# EAGLE design C64_PSU_Z66 (EAGLE 9.6.2)
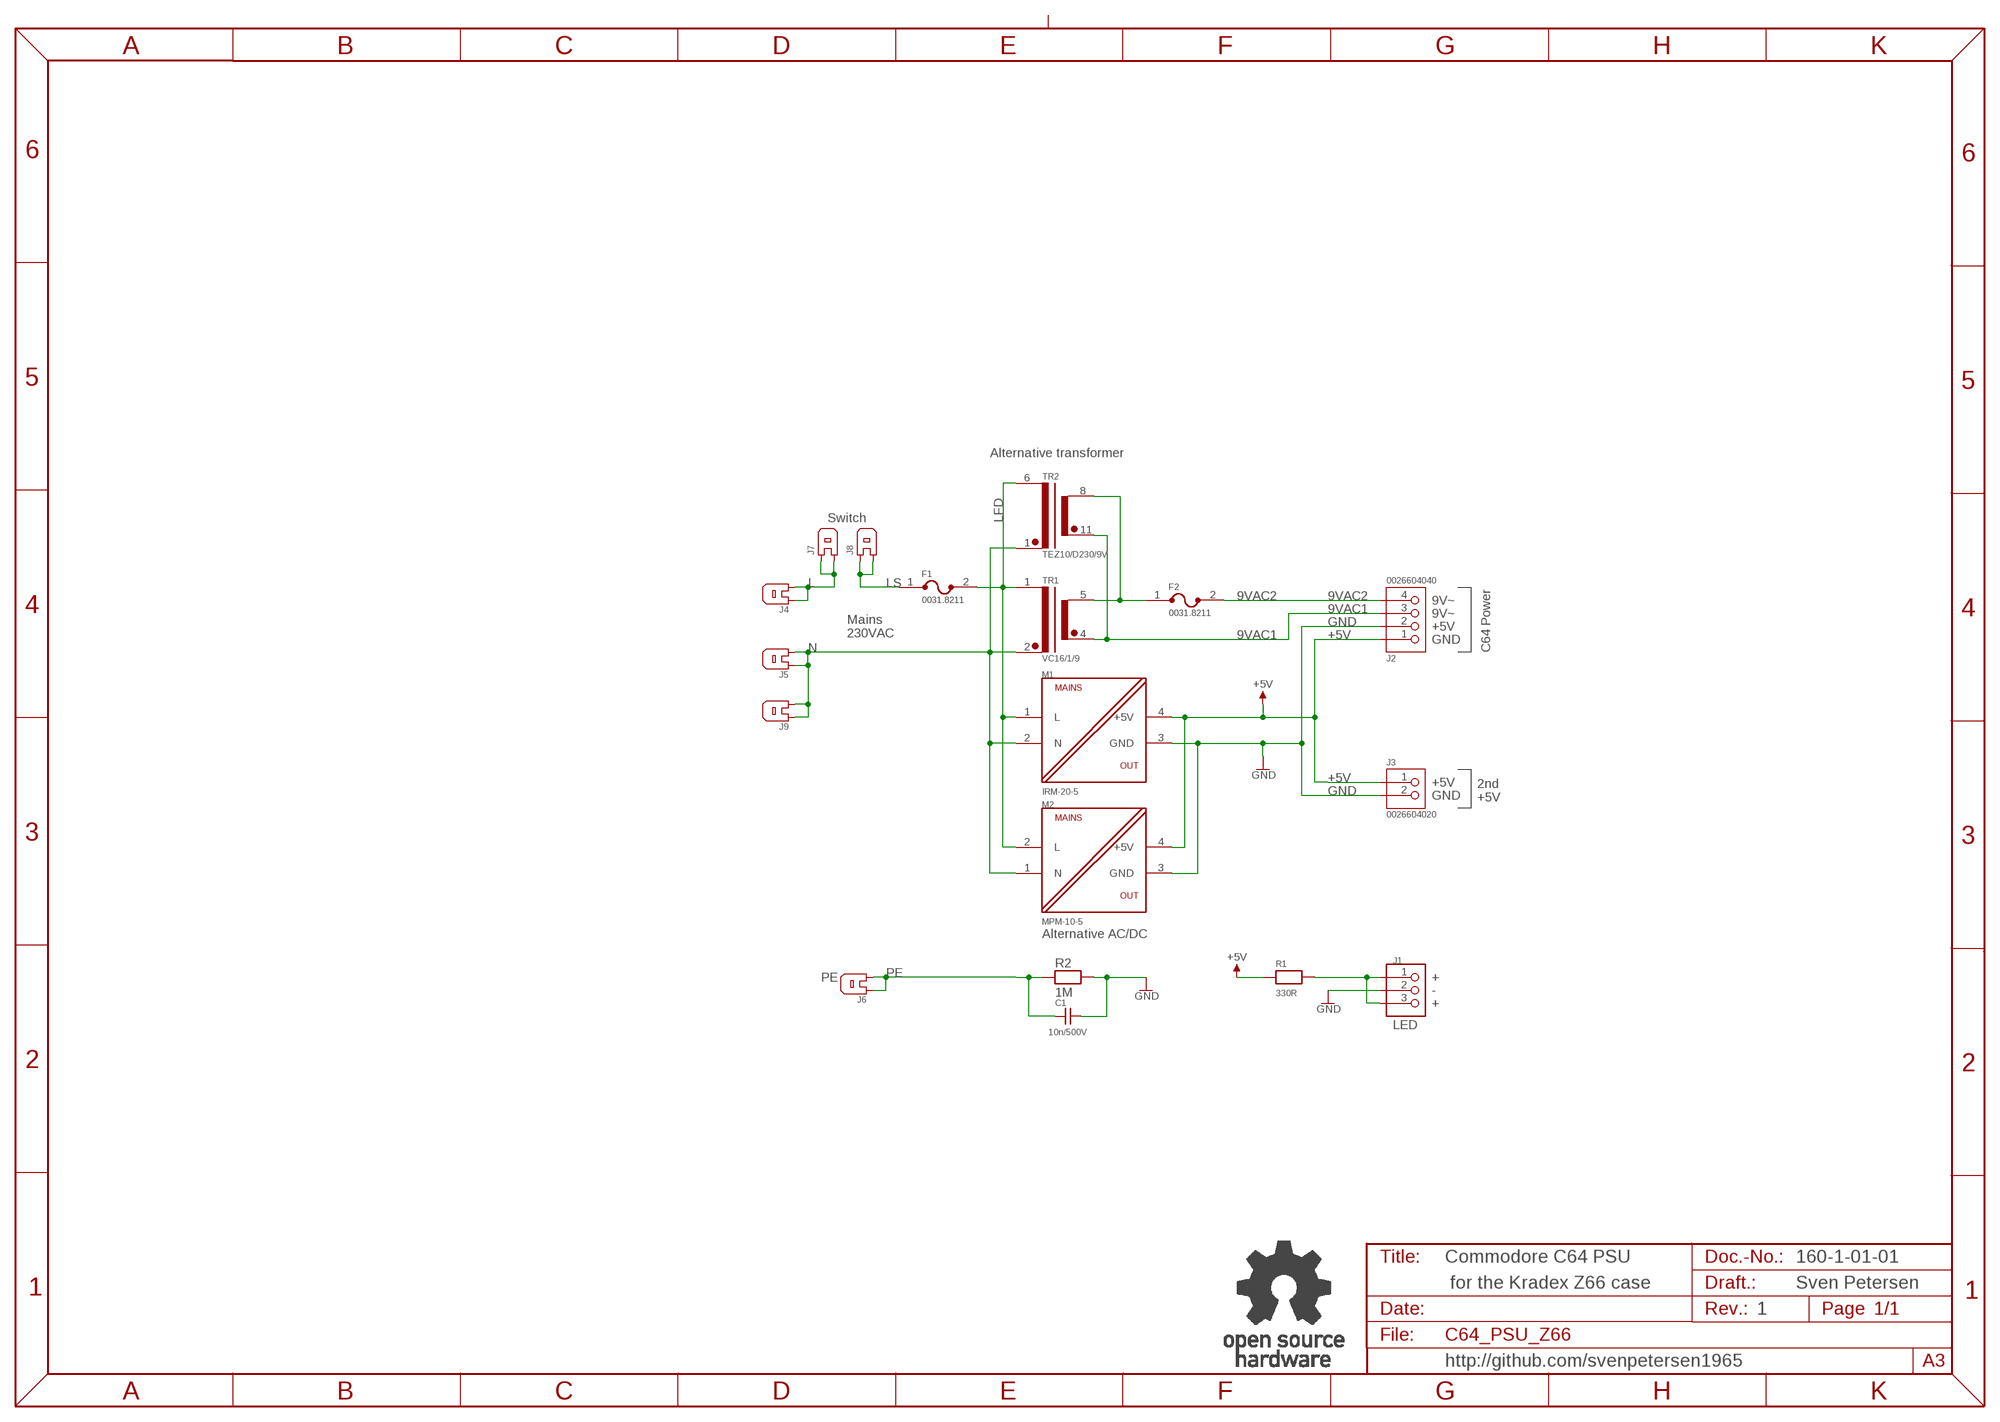
[diagram p0: schematic, sheet 1]

## Parts
C1  10n/500V  CAP02  [C-5]
F1  0031.8211  [0031.8211]
F2  0031.8211  [0031.8211]
J1  PINHD-1X3  [1X03]
J2  0026604040  [SPOX_3.96_4P]
J3  0026604020  [SPOX_3.96_2P]
J4  FLA6,3  [FLA6,3]
J5  FLA6,3  [FLA6,3]
J6  FLA6,3  [FLA6,3]
J7  FLA6,3  [FLA6,3]
J8  FLA6,3  [FLA6,3]
J9  FLA6,3  [FLA6,3]
M1  IRM-20-5  [IRM-5-20]
M2  MPM-10-5  [MPM10]
R1  330R  RES04  [R-10]
R2  1M  RES04  [R-10]
TR1  VC16/1/9  [VC16/1/9]
TR2  TEZ10/D230/9V  [TEZ10]
U$8  OPEN_SOURCE_HW  [OPENHW]

## Nets
9VAC1: J2.3 TR1.4(SEC12) TR2.11(SEC12)
9VAC2: F2.2 J2.4
+5V: J2.1 J3.1 M1.4(+5V) M2.4(+5V) R1.1
GND: C1.2 J1.2 J2.2 J3.2 M1.3(GND) M2.3(GND) R2.2
L [mains]: J4.1 J4.2 J7.1 J7.2
LFD [mains]: F1.2 M1.1(L) M2.2(L) TR1.1(PRI1) TR2.6(PRI1)
LS [mains]: F1.1 J8.1 J8.2
N [mains]: J5.1 J5.2 J9.1 J9.2 M1.2(N) M2.1(N) TR1.2(PRI2) TR2.1(PRI2)
N$2: J1.1 J1.3 R1.2
N$3: F2.1 TR1.5(SEC11) TR2.8(SEC11)
PE [PE]: C1.1 J6.1 J6.2 R2.1

## Notes on the sheet
- Alternative transformer
- Switch
- 9V~
- 9V~
- Mains
  230VAC
- +5V
- GND
- C64 Power
- +5V
- GND
- 2nd
  +5V
- Alternative AC/DC
- PE | +
- -
- +
- LED
- Commodore C64 PSU | 160-1-01-01
- for the Kradex Z66 case | Sven Petersen
- 1
- http://github.com/svenpetersen1965

## Library data of the parts
C1 = DISCRETE:CAP02
F1 F2 = Schurter:0031.8211
J1 = PINHEAD:PINHD-1X3
J2 = MOLEX:0026604040
J3 = MOLEX:0026604020
J4-J9 = Connect:FLA6,3
M1 = MeanWell:IRM-20-5
M2 = MeanWell:MPM-10-5
R1 R2 = DISCRETE:RES04
TR1 = Block:VC16/1/9
TR2 = Breve Tufvassons:TEZ10/D230/9V: tme.eu: TEZ10/D/9V
U$8 = Logo:OPEN_SOURCE_HW

## Net classes
0 default: clearance 0.203 mm
1 mains: width 1 mm, clearance 5 mm to class 0, clearance 5 mm
2 PE: clearance 1.5 mm to class 0, clearance 5 mm to class 1, clearance 0.203 mm

## Board
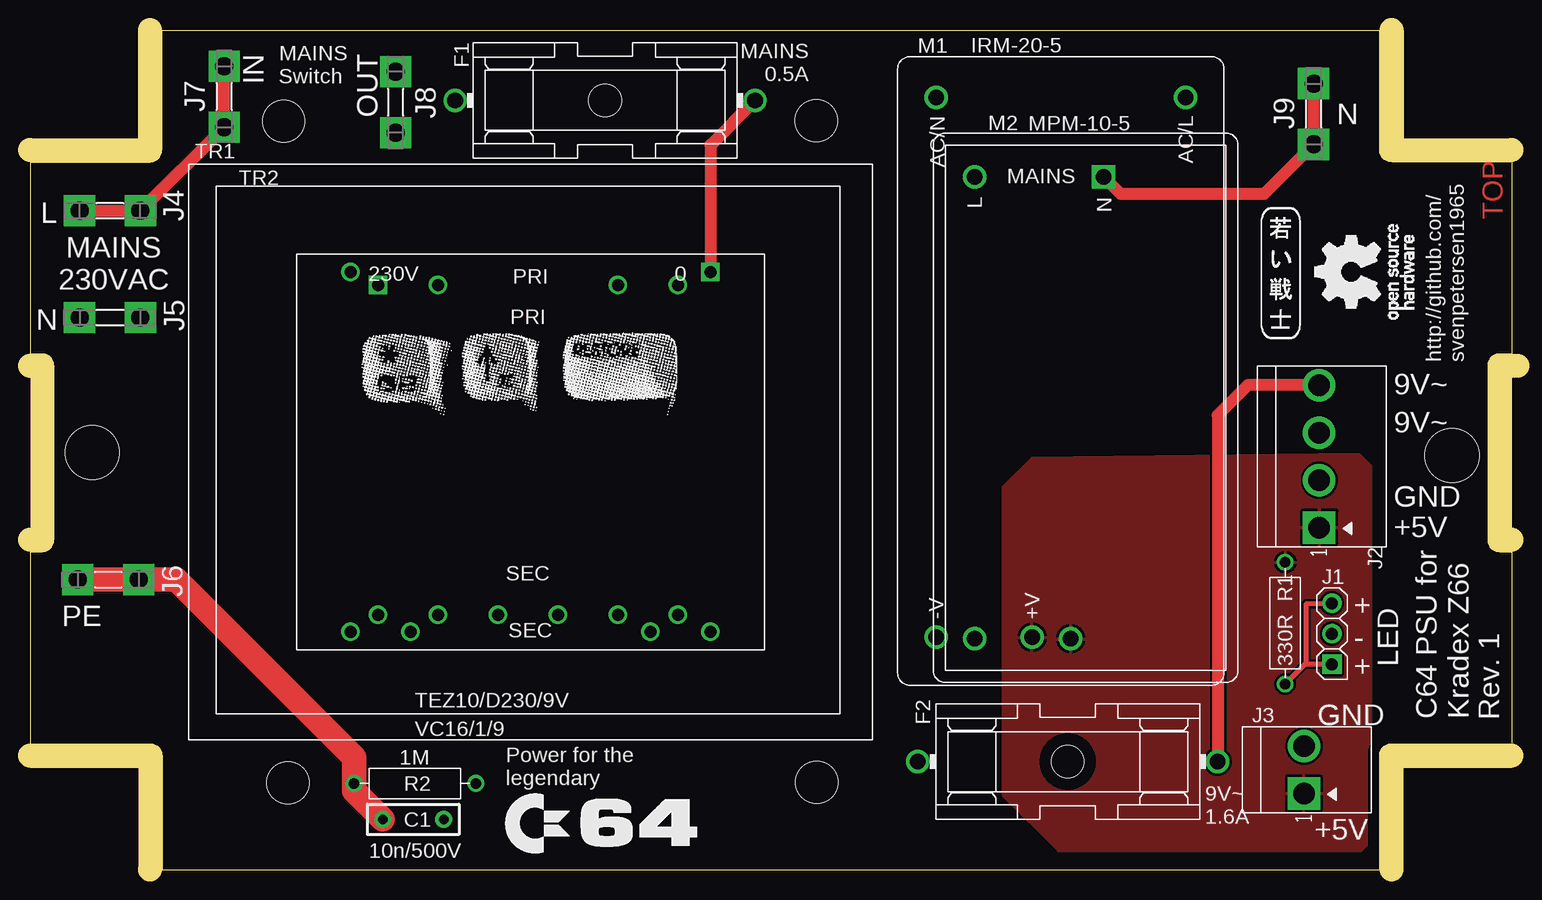
[diagram p1: board, top side]
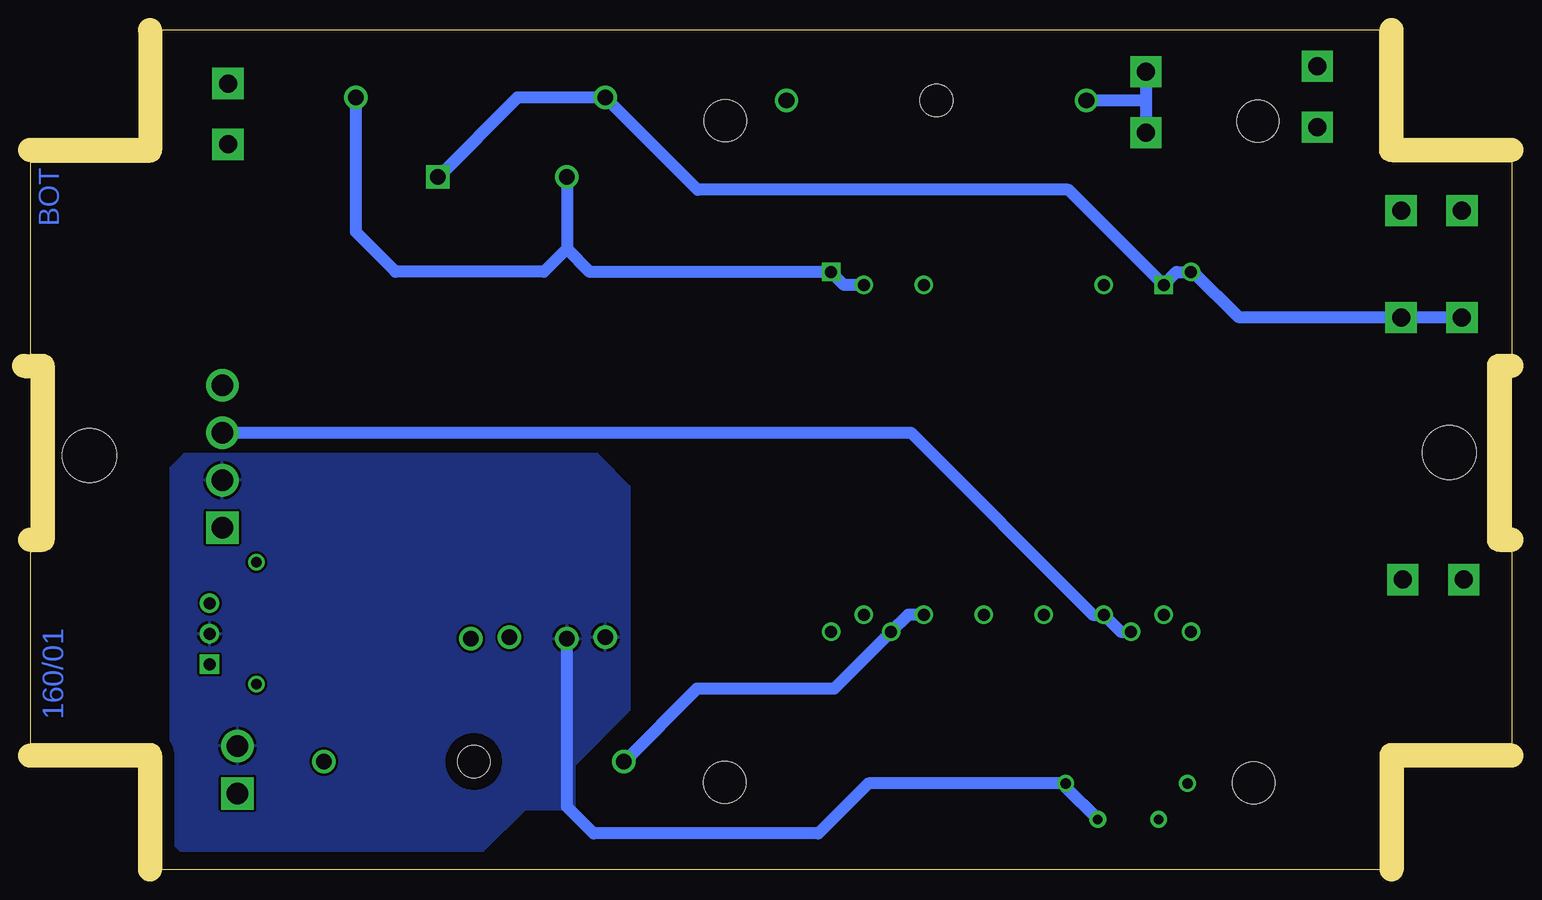
[diagram p2: board, bottom side, seen from below]

Size 123.5 x 70 mm. Coordinates in mm from the lower left corner, seen from the top.
Outline: 11,0 112.5,0 112.5,9.5 arc-90 113.5,10.5 123.5,10.5 123.5,26.5 122.5,26.5 arc-90 121.5,27.5 121.5,42 arc-90 122.5,43 123.5,43 123.5,59 113.5,59 arc-90 112.5,60 112.5,70 11,70 11,60 arc-90 10,59 0,59 0,43 1,43 arc-90 2,42 2,27.5 arc-90 1,26.5 0,26.5 0,10.5 10,10.5 arc-90 11,9.5 11,0
Copper layers (1*16): Top 0.035mm / dielectric 1.5mm / Bottom 0.035mm
Design rules "default *": minimum track width 6mil, minimum drill 0.35mm, track to track 6mil, track to pad 6mil, pad to pad 6mil, via to via 6mil, smd to smd 6mil, copper to edge 40mil, drill to drill 6mil, minimum pad ring 10mil, minimum via ring 8mil, stop-mask expansion 4mil, vias tented up to drill 25mil, thermal gap 10mil
Milling: 14 lines

### Footprints (pad centres in the part's own frame; a part is rotated, then mirrored left to right if it is on the bottom)
C-5 = drill 0.8 pad 1.397: 1 -2.54,0; 2 2.54,0
0031.8211 = drill 1.3: 1 -12.5,0; 2 12.5,0 | hole 2.7: 0,0
1X03 = drill 1 pad 1.626 square: 1 -2.54,0 | drill 1 pad 1.626: 2 0,0; 3 2.54,0
SPOX_3.96_4P = drill 1.8 square: 1 -5.94,0 | drill 1.8: 2 -1.98,0; 3 1.98,0; 4 5.94,0
SPOX_3.96_2P = drill 1.8 square: 1 -1.98,0 | drill 1.8: 2 1.98,0
FLA6,3 = drill 1.5 pad 2.591 square: 1 -2.54,0; 2 2.54,0
IRM-5-20 = drill 1.3: 1 -22.5,10.4; 2 -22.5,-10.4; 3 22.5,-10.4; 4 22.5,-2.4
MPM10 = drill 1.3 square: 1 -19.25,1.5 | drill 1.3: 2 -19.25,-9.25; 3 19.25,-9.25; 4 19.25,-1.25
R-10 = drill 0.889 pad 1.397: 1 -5.08,0; 2 5.08,0
VC16/1/9 = drill 1 square: 1 -15,15 | drill 1: 2 -15,-15; 3 15,-15; 4 15,-10; 5 15,10; 6 15,15
TEZ10 = drill 1 square: 1 -12.5,13.75 | drill 1: 2 -7.5,13.75; 5 7.5,13.75; 6 12.5,13.75; 7 12.5,-13.75; 8 7.5,-13.75; 9 2.5,-13.75; 10 -2.5,-13.75; 11 -7.5,-13.75; 12 -12.5,-13.75
Z66 = hole 4.5: 5.686,35.275; 119.035,35.025 | hole 3.5: 21.651,62.89; 21.996,7.733; 66.041,62.93; 66.076,7.773

### Placement (x,y rotation side)
C1  31.95,4.18 0 top
F1  47.93,64.13 0 top
F2  86.5,9 0 top
J1  108.52,19.66 90 top
J2  107.47,34.45 90 top
J3  106.2,8.32 90 top
J4  6.67,54.93 180 top
J5  6.67,46.02 0 top
J6  6.51,24.17 0 top
J7  16.19,64.45 90 top
J8  30.48,63.98 270 top
J9  107,63 90 top
M1  85.93,41.87 270 top
M2  88,38.5 270 top
R1  104.63,20.54 270 top
R2  32.09,7.18 0 top
TR1  41.71,34.83 270 top
TR2  41.5,35 0 top
U$7  [Z66]  -0.5,-0.5 0 top
U$8  115.35,45.9 90 top
U$9  [C64_LOGO]  39.62,1.35 0 top
U$10  [PCB-TITLE/]  0.16,75.41 0 top  (outside the outline)
U$11  [2LAYER]  122.76,54.22 90 top
U$12  [C64_KEYS]  27.62,37.31 0 top
U$13  [SVEN_TAG]  104.3,49.85 0 top

### Tracks (layer width: path | path; a pad name or v marks a point on that pad's centre or on a via)
9VAC1
  Bottom 1.016: TR1.4 32.58,19.83 TR2.11 34.9,21.25 50.08,36.43 J2.3
9VAC2
  Top 1.016: J2.4 101.51,40.39 99,37.88 F2.2
+5V
  pour Top: 81.12,31.91 81.12,6.19 85.72,1.59 110.97,1.59 111.76,2.38 111.76,33.66 110.81,34.61 83.5,34.29
GND
  Bottom 1.016: C1.2 37.17,6.86 R2.2 53.62,7.18 57.78,3.02 76.52,3.02 78.75,5.25 M2.3
  pour Bottom: 73.5,31.91 76.2,34.61 110.65,34.61 111.76,33.5 111.76,2.38 110.97,1.59 85.72,1.59 82.23,5.08 78.26,5.08 78.11,5.24 78.11,8.73 73.5,13.34
L
  Top 1.016: J4.2 J4.1 J7.1 J7.2
LFD
  Top 1.016: F1.2 56.71,60.41 TR1.1
  Bottom 1.016: TR2.6 55.63,48.75 TR1.1 76.82,49.83 78.75,51.76 | M2.2 78.75,51.76 | 78.75,51.76 80.67,49.85 93.03,49.85 96.33,53.15 M1.1
LS
  Bottom 1.016: J8.1 30.48,64.13 | 30.48,64.13 J8.2 | F1.1 30.48,64.13
N
  Top 1.016: M2.1 90.93,56.32 102.86,56.32 J9.1 J9.2
  Bottom 1.016: M2.1 82.88,64.37 M1.2 67.83,56.67 36.92,56.67 TR2.1 27.92,49.83 TR1.2 26.55,49.83 22.79,46.06 9.25,46.06 J5.2 J5.1
N$2
  Top 0.406: R1.2 106.29,17.12 106.36,17.19 | J1.3 108.45,22.13 106.36,22.13 106.36,17.19 | J1.1 106.44,17.12 106.36,17.19
N$3
  Bottom 1.016: TR2.8 50.29,21.25 TR1.5 56.46,15.08 67.92,15.08 F2.1
PE
  Top 2.032: C1.1 27.01,6.58 R2.1 27.01,9.34 12.18,24.17 J6.2 J6.1

### Text on the board
Bottom: 160/01
tPlace: IN | OUT | IRM-20-5 | MAINS / Switch | MAINS / 0.5A | N | MPM-10-5 | L | MAINS / 230VAC | N | http://github.com/ / svenpetersen1965 | 9V~ | 9V~ | GND | +5V | + | PE | - | LED | 330R | + | TEZ10/D230/9V | GND | C64 PSU for / Kradex Z66 | Rev. 1 | VC16/1/9 | 1M | Power for the / legendary | 9V~ / 1.6A | +5V | 10n/500V
Document: 160-2-01-01 | Sven Petersen / 2021 | 35µm | 2 | 1
Reference: Kradex Z66